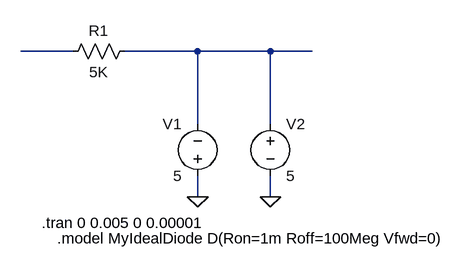
[diagram p0: schematic Draft1.asc]
Draft1.asc, the LTspice schematic file:
Version 4
SHEET 1 880 680
WIRE 48 128 -32 128
WIRE 240 128 128 128
WIRE 352 128 240 128
WIRE 416 128 352 128
WIRE 240 240 240 128
WIRE 352 240 352 128
WIRE 240 352 240 320
WIRE 352 352 352 320
FLAG 240 352 0
FLAG 352 352 0
SYMBOL res 144 112 R90
WINDOW 0 0 56 VBottom 2
WINDOW 3 32 56 VTop 2
SYMATTR InstName R1
SYMATTR Value 5K
SYMBOL voltage 240 336 R180
WINDOW 0 24 96 Left 2
WINDOW 3 24 16 Left 2
SYMATTR InstName V1
SYMATTR Value 5
SYMBOL voltage 352 224 R0
SYMATTR InstName V2
SYMATTR Value 5
TEXT 0 392 Left 2 !.tran 0 0.005 0 0.00001
TEXT 24 416 Left 2 !.model MyIdealDiode D(Ron=1m Roff=100Meg Vfwd=0)

The netlist it stands for:
* Draft1.asc
R1 N002 N001 5K
V1 0 N002 5
V2 N002 0 5
.tran 0 0.005 0 0.00001
.model MyIdealDiode D(Ron=1m Roff=100Meg Vfwd=0)
.backanno
.end